# EAGLE schematic opto-isolated adapter (EAGLE 8.1.0)
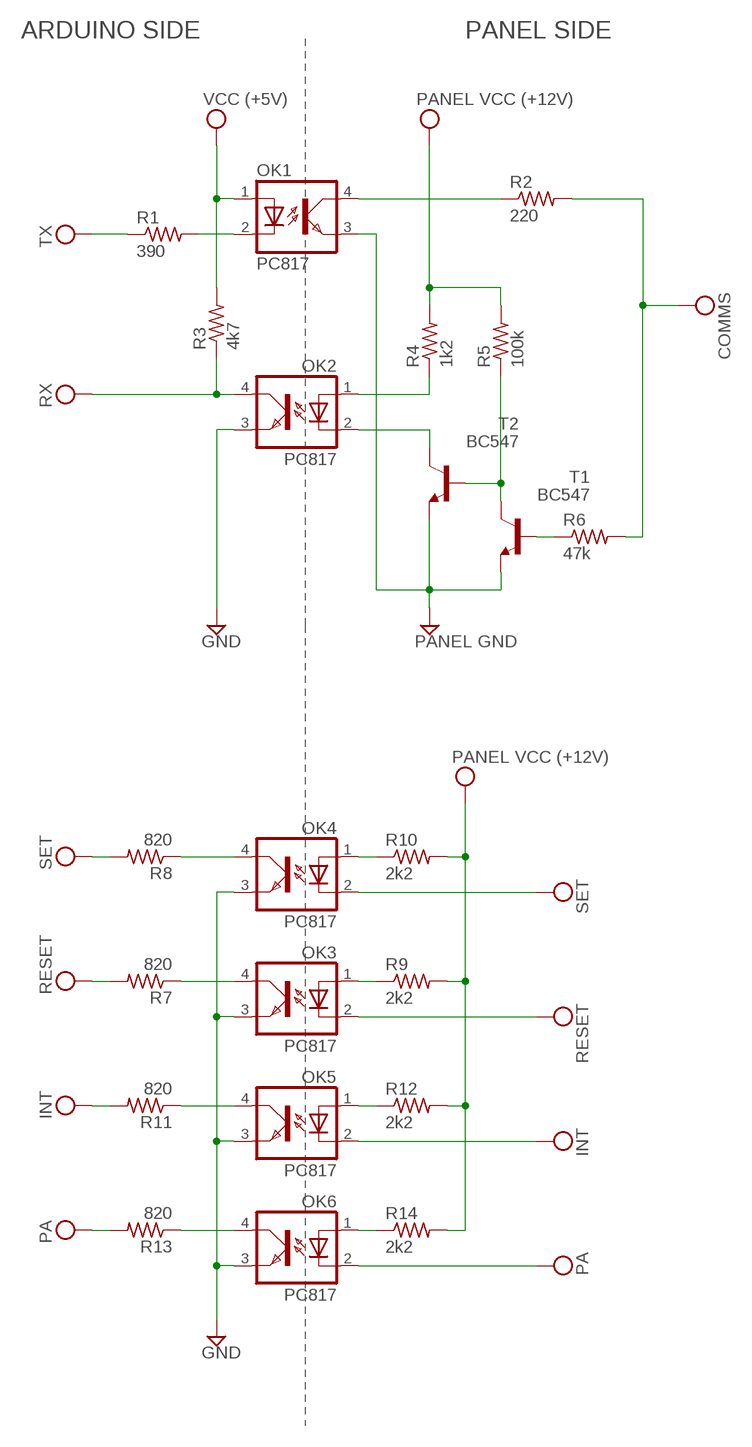
[diagram p0: schematic, sheet 1]

## Parts
OK1  PC817  [DIL04]
OK2  PC817  [DIL04]
OK3  PC817  [DIL04]
OK4  PC817  [DIL04]
OK5  PC817  [DIL04]
OK6  PC817  [DIL04]
R1  390  R-US_0207/12  [0207/12]
R2  220  R-US_0207/12  [0207/12]
R3  4k7  R-US_0207/12  [0207/12]
R4  1k2  R-US_0207/12  [0207/12]
R5  100k  R-US_0207/12  [0207/12]
R6  47k  R-US_0207/12  [0207/12]
R7  820  R-US_0207/12  [0207/12]
R8  820  R-US_0207/12  [0207/12]
R9  2k2  R-US_0207/12  [0207/12]
R10  2k2  R-US_0207/12  [0207/12]
R11  820  R-US_0207/12  [0207/12]
R12  2k2  R-US_0207/12  [0207/12]
R13  820  R-US_0207/12  [0207/12]
R14  2k2  R-US_0207/12  [0207/12]
T1  BC547  [TO92]
T2  BC547  [TO92]

## Nets
GND1: OK1.3(EMIT) OK2.3(EMIT) OK3.3(EMIT) OK4.3(EMIT) OK5.3(EMIT) OK6.3(EMIT) T1.1(E) T2.1(E) ; supply symbol labelled PANEL GND, GND
N$1: OK1.2(C) R1.2
N$2: OK3.1(A) R9.1
N$3: OK1.4(COL) R2.1
N$4: OK3.4(COL) R7.1
N$5: OK4.4(COL) R8.1
N$6: OK2.1(A) R4.1
N$7: OK2.2(C) T2.3(C)
N$8: R5.1 T1.3(C) T2.2(B)
N$9: OK5.1(A) R12.1
N$10: R6.1 T1.2(B)
N$11: OK4.1(A) R10.1
N$12: OK5.4(COL) R11.1
N$13: OK6.1(A) R14.1
N$14: OK6.4(COL) R13.1
VCC: OK1.1(A) OK2.4(COL) OK3.2(C) OK4.2(C) OK5.2(C) OK6.2(C) R1.1 R2.2 R3.1 R3.2 R4.2 R5.2 R6.2 R7.2 R8.2 R9.2 R10.2 R11.2 R12.2 R13.2 R14.2 ; supply symbol labelled VCC (+5V), PANEL VCC (+12V), TX, RX, COMMS, SET, RESET, INT, PA

## Notes on the sheet
- ARDUINO SIDE | PANEL SIDE

## Library data of the parts
OK1-OK6 = optocoupler:PC817: SHARP OPTO COUPLER; MPN: PC817X4J000F; OC_FARNELL: 9707727; OC_NEWARK: 97K7059
R1-R14 = rcl:R-US_: RESISTOR, American symbol
T1 T2 = transistor:BC547: NPN TRANSISTOR